# Altium schematic sheet Power.SchDoc
size A4
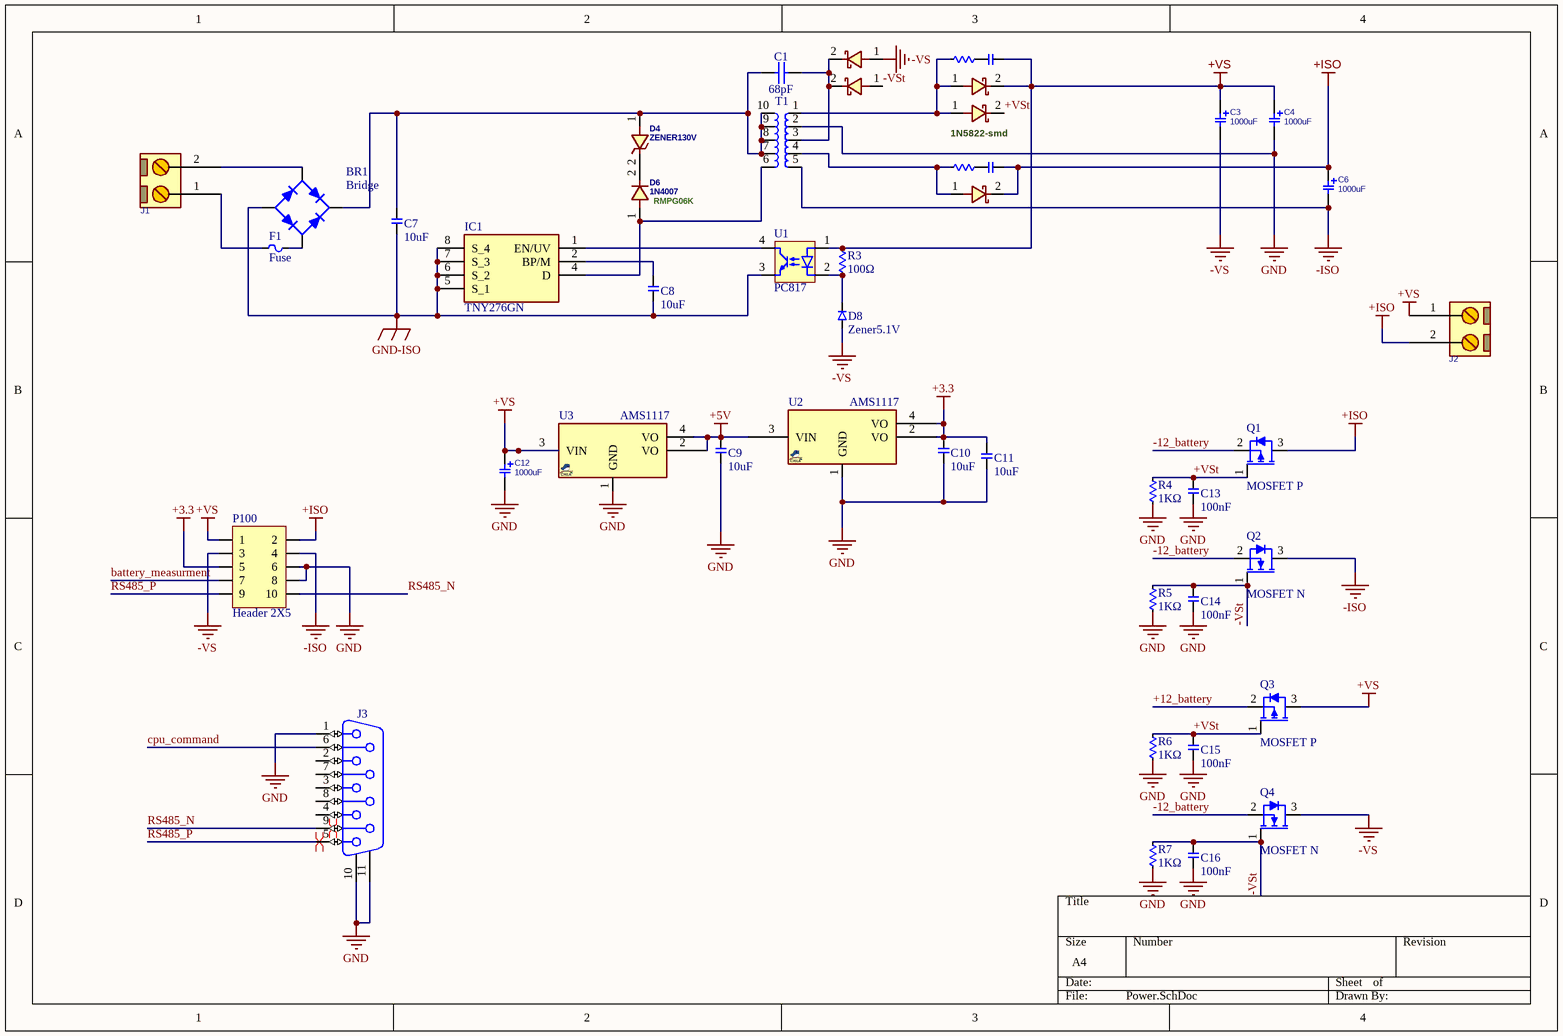
[diagram p0: Power.SchDoc]

## Parts
BR1  Bridge  [SOP254P690X270-4L]
C1  68pF  [C_CER_D12]
C2  560pF  [CAP 0603 560p]  (value not drawn)
C3  1000uF  [C_EL_10X12]
C4  1000uF  [C_EL_10X12]
C5  560pF  [CAP 0603 560p]  (value not drawn)
C6  1000uF  [C_EL_10X12]
C7  10uF  [C_EL_10X12]
C8  10uF  [C_CER_M5]
C9  10uF  [CAP 0805 10u]
C10  10uF  [CAP 0805 10u]
C11  10uF  [CAP 0805 10u]
C12  1000uF  [C_EL_10X12]
C13  100nF  [CAP 0603 100n]
C14  100nF  [CAP 0603 100n]
C15  100nF  [CAP 0603 100n]
C16  100nF  [CAP 0603 100n]
D1  SS34  [D_SMB]  (value not drawn)
D2  SS34  [d_sod123w]  (value not drawn)
D3  SS34  [D_SMB]  (value not drawn)
D4  ZENER130V  [D_SMB]
D5  SS34  [D_SOD123W]  (value not drawn)
D6  1N4007  [D_SMB]
D7  SS34  [D_SMB]  (value not drawn)
D8  Zener5.1V  [DIOMELF3515L]
F1  Fuse  [Fuse 2410]
IC1  TNY276GN  [SMD-8C]
J1  CONN_TB2  [TBG_2]  (value not drawn)
J2  CONN_TB2  [TBG_2]  (value not drawn)
J3  D-Sub 9F  [FCI_D09S24A4GV00LF]  (value not drawn)
P100  Header 2X5  [HDR 2X5 F ST 2.54]
Q1  MOSFET P  [SOT23]
Q2  MOSFET N  [SOT23]
Q3  MOSFET P  [SOT23]
Q4  MOSFET N  [SOT23]
R1  18Ω  [RES 0603 18]  (value not drawn)
R2  18Ω  [RES 0603 18]  (value not drawn)
R3  100Ω  [RES 0603 100]
R4  1KΩ  [RES 0603 1K]
R5  1KΩ  [RES 0603 1K]
R6  1KΩ  [RES 0603 1K]
R7  1KΩ  [RES 0603 1K]
T1  Transformer 5+5  [EE19 5+5]  (value not drawn)
U1  PC817  [PC817]
U2  AMS1117  [SOT223_4]
U3  AMS1117  [SOT223_4]

## Nets
+3.3: C10.1 C11.1 P100.5 U2.2(VO) U2.4(VO)
+5V: C9.1 U2.3(VIN) U3.2(VO) U3.4(VO)
+ISO: C5.2 C6.1 D7.2 J2.2 P100.2 Q1.3(D)
+VS: C2.2 C3.1 C4.1 C12.1 D3.2 J2.1 P100.1 Q3.3(D) R3.2 U1.1 U3.3(VIN)
-ISO: C6.2 P100.4 Q2.3(D) T1.5
-VS: C3.2 D1.1 D8.2 P100.3 Q4.3(D)
GND: C4.2 C9.2 C10.2 C11.2 C12.2 C13.2 C14.2 C15.2 C16.2 J3.1 J3.10 J3.11 P100.6 P100.8 R4.2 R5.2 R6.2 R7.2 T1.2 U2.1(GND) U3.1(GND)
GND-ISO: BR1.2(-) C7.2 C8.2 IC1.5(S_1) IC1.6(S_2) IC1.7(S_3) IC1.8(S_4) U1.3
+12_battery: Q3.2(S)
+VSt: C13.1 C15.1 D5.2 Q1.1(G) Q3.1(G) R4.1 R6.1
-12_battery: Q1.2(S) Q2.2(S) Q4.2(S)
-VSt: C14.1 C16.1 D2.1 Q2.1(G) Q4.1(G) R5.1 R7.1
battery_measurment: P100.7
cpu_command: J3.6
RS485_N: J3.9 P100.10
RS485_P: J3.5 P100.9
NetBR1_1: BR1.1(+) C1.1 C7.1 D4.1 T1.7 T1.8 T1.9 T1.10
NetBR1_3: BR1.3 F1.2
NetBR1_4: BR1.4 J1.2
NetC1_2: C1.2 D1.2 D2.2 T1.3
NetC2_1: C2.1 R1.2
NetC5_1: C5.1 R2.2
NetC8_1: C8.1 IC1.2(BP/M)
NetD3_1: D3.1 D5.1 R1.1 T1.1
NetD4_2: D4.2 D6.2
NetD6_1: D6.1 IC1.4(D) T1.6
NetD7_1: D7.1 R2.1 T1.4
NetD8_1: D8.1 R3.1 U1.2
NetF1_1: F1.1 J1.1
NetIC1_1: IC1.1(EN/UV) U1.4

Not connected (* = marked no-connect by the designer): J3 2 3 4 7 8

## Layout directives
differential pair: RS485_N, RS485_P

## Notes on the sheet
- 1N5822-smd
- (near D6) RMPG06K

## Library data of the parts
C1 = CCR_68PF_760VAC_10%_VISHAY_VY1: Non-polarised capacitor; Part Description: AC Line Rated Disc Capacitor (Y5S, Class X1); Manufacturer: VISHAY BCCOMPONENTS; Manufacturer Part Number: VY1680K31Y5SQ6UV0; Voltage: 760VAC; Tolerance: ±10%; Part Number: CCR_68PF_760VAC_10%_VISHAY_VY1; Component Kind: Standard; Component Type: Standard; Footprint: CAPRB1000W60L800T500H1200; Pin Count: 2; Value: 68pF; Status: None; Case: LS10 D8 x W5 x H12; Mounted: Yes; Socket: No; SMD: No; Sense: No; ComponentHeight: 12mm; HelpURL: \\cern.ch\dfs\Applications\Altium\Datasheets\CCR_VISHAY_VY1.pdf; Author: CERN DEM JLC; CreateDate: 5/27/2013; LatestRevisionDate: 5/27/2013
C2 C5 = CAP 560pF
C3 C4 C6 C12 = CAP_THD_EL_10u25V: CAP, THD, ELEC, 10uF, 25V; MANF_P#: MANF_PART#; PARAM: 25V; MANF: MANF; PARAM2: PARAM2; VALUE: 1000uF
C7-C11 = CAP 10uF
C13-C16 = CAP 100nF
D1-D3 D5 D7 = DIODE_SMD_SCHOTTKY_SS34: DIODE, SCHOTTKY, 20V, 3A; MANF: VISHAY; DESC: DESCRIPTION; MANF_P#: SS34; ASSEMBLY: ASSEMBLY; PRICE: PRICE; PARAM2: 3A; PARAM: 20V; VALUE: SS34
D4 = DIODE_THD_ZENER_1W: DIODE, ZENER, 1W; MANF: Diodes; DESC: DESCRIPTION; PARAM2: 0.2W; PARAM: 15V; MANF_P#: ZENER15V; ASSEMBLY: ASSEMBLY; PRICE: PRICE; VALUE: ZENER130V
D6 = DIODE_THD_1N4007: DIODE, GENERAL PURPOSE, 1000V/1A; MANF: Diodes; DESC: DESCRIPTION; PARAM: 1000V, 1.15V; PARAM2: 1.5A; ASSEMBLY: ASSEMBLY; PRICE: PRICE; MANF_P#: 1N4007; VALUE: 1N4007
D8 = Diode
IC1 = TNY276GN: Integrated Circuit; Manufacturer_Name: Power Integrations; Datasheet Link: https://www.power.com/sites/default/files/product-docs/tny274-280.pdf; Manufacturer_Part_Number: TNY276GN; Mouser Part Number: 869-TNY276GN; Mouser Price/Stock: https://www.mouser.co.uk/ProductDetail/Power-Integrations/TNY276GN?qs=WS5Jv%252B%252Bx1qUyDN8fA3lScQ%3D%3D; RS Part Number: 0533737; RS Price/Stock: http://uk.rs-online.com/web/p/products/0533737
J1 J2 = CONN_TB2: CONN, TERMINAL BLOCK, 5.08mm pitch; VALUE: CONN_TB2
J3 = FCI_D09S24A4GV00LF: Connector D-sub 9 Female; Part Description: Straight D-SUB 9 Female Contacts for PCB  with Harpoons and Female Screwlock (UNC4-40) and Elec. Continuity; Manufacturer: FCI; PressFit: No; Part Number: FCI_D09S24A4GV00LF; Component Kind: Standard; Component Type: Standard; Pin Count: 11; Family: D-Sub 9F; Mounted: Yes; Socket: No; SMD: No; Sense: No; Status: None; Manufacturer Part Number: D09S24A4GV00LF; ComponentHeight: 12.39mm; HelpURL: \\cern.ch\dfs\Applications\Altium\Datasheets\FCI_D09S24A4GV00LF.pdf; Author: CERN DEM JMW; CreateDate: 06/06/2008; LatestRevisionDate: 06/06/2008
R1 R2 = RES 18
R3 = RES 100
R4-R7 = RES 1K
U2 U3 = VREG_1117_SOT223: REG, Linear, LDO1V, 0.8A, SOT-223; MANF_P#: LD1117, LM1117, AMS1117, TLV1117, REG1117, NCP1117, LT1117, SPX1117; MANF: TI, ON, ST; PARAM2: 1.2/1.5/1.8/2.5/2.85/3.3/5V; PARAM: LDO1V, 0.8A; VALUE: AMS1117